# EAGLE design CortexM0DevelopmentBoard (EAGLE 9.6.2)

## Sheet 1 of 2
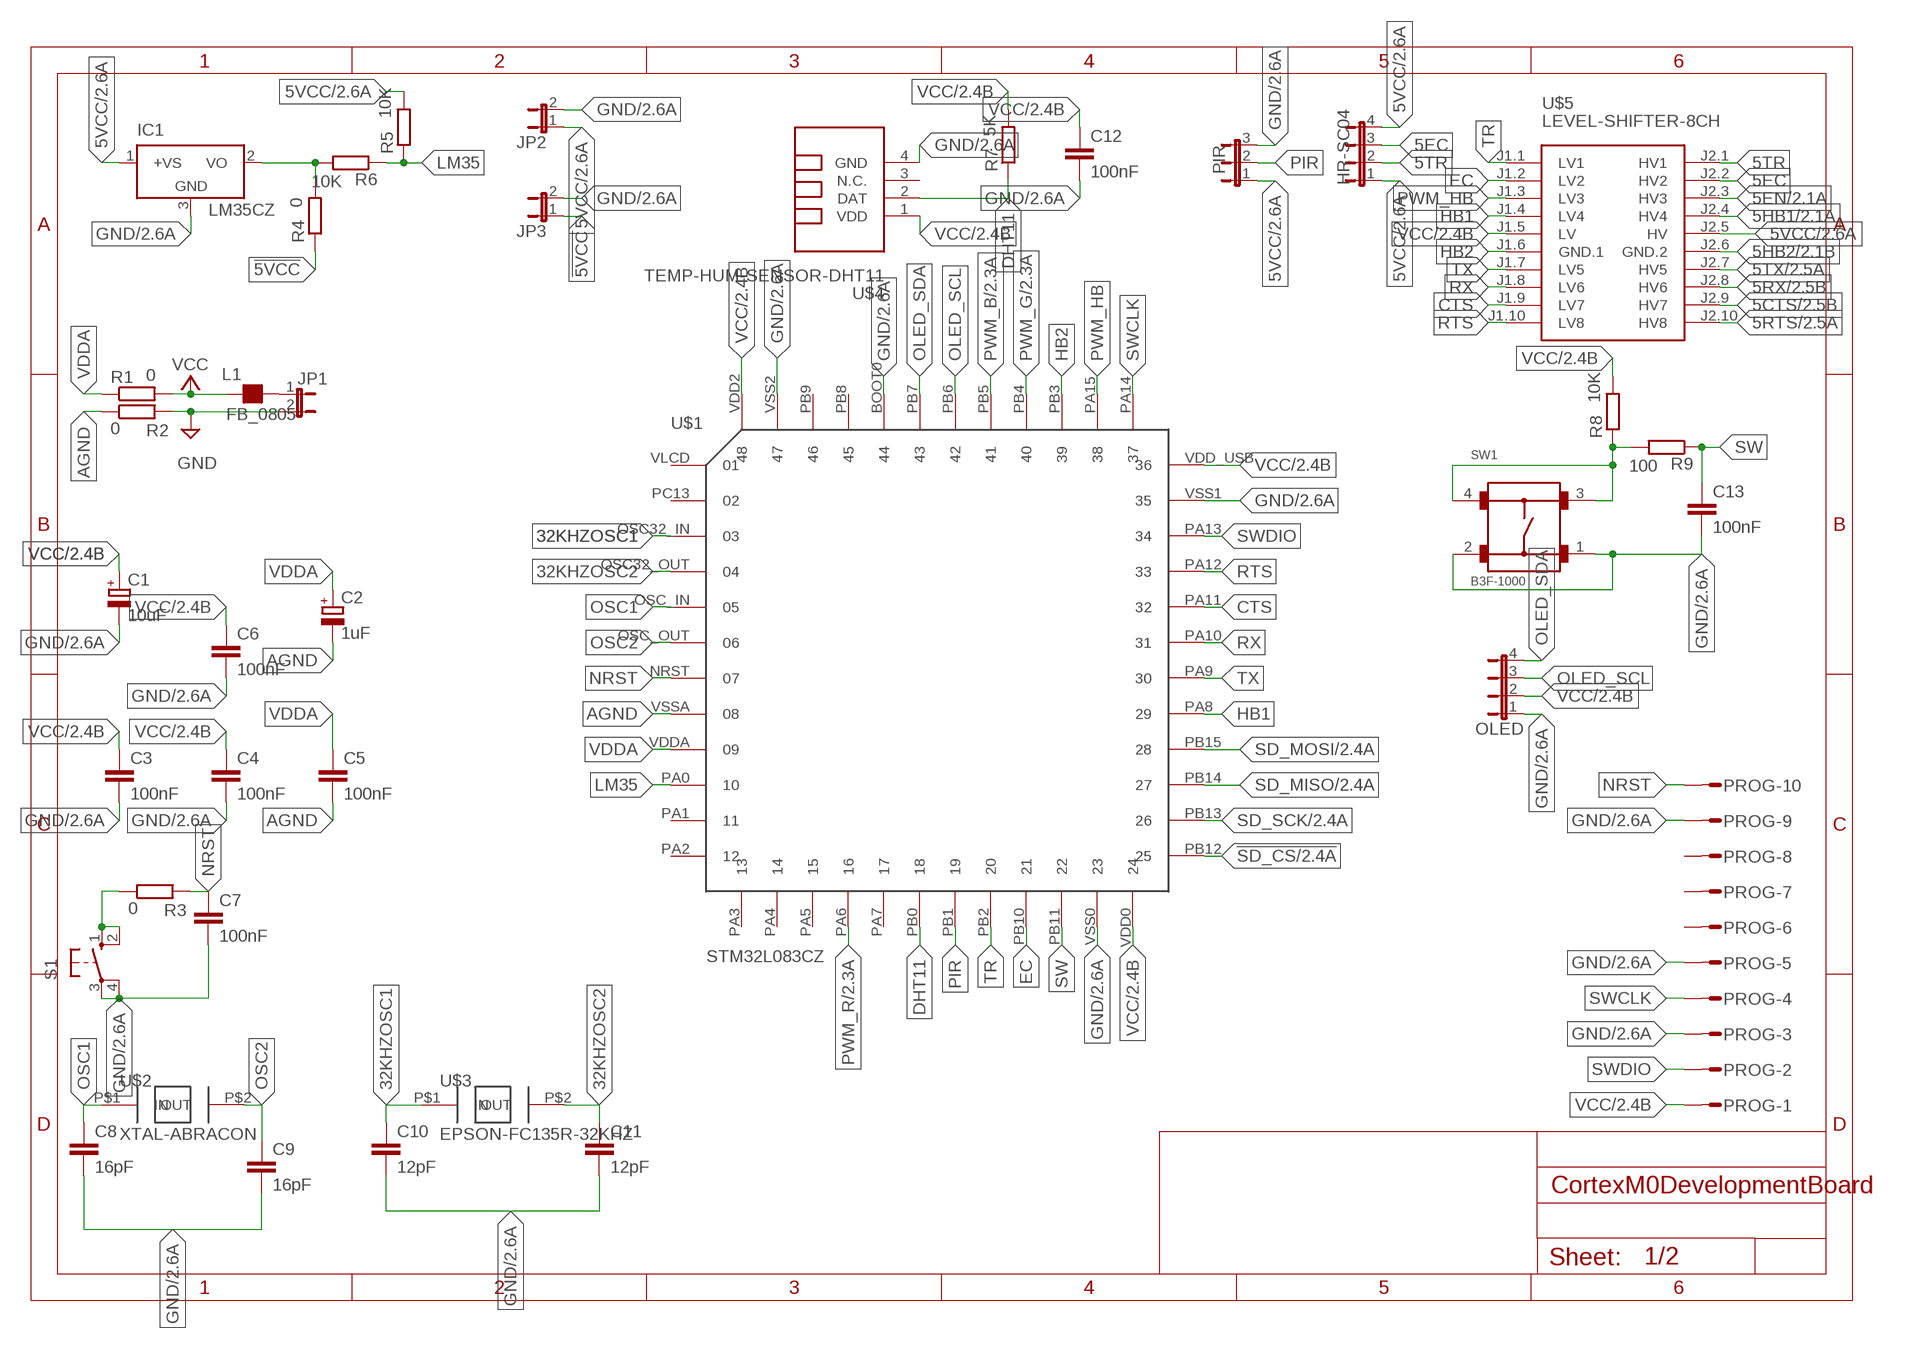
[diagram p0: schematic, sheet 1]

### Parts
C1  10uF  CPOL-EU139CLL-2R  [139CLL-2R]
C2  1uF  CPOL-EU139CLL-2R  [139CLL-2R]
C3  100nF  C-EUC0805  [C0805]
C4  100nF  C-EUC0805  [C0805]
C5  100nF  C-EUC0805  [C0805]
C6  100nF  C-EUC0805  [C0805]
C7  100nF  C-EUC0805  [C0805]
C8  16pF  C-EUC0805  [C0805]
C9  16pF  C-EUC0805  [C0805]
C10  12pF  C-EUC0805  [C0805]
C11  12pF  C-EUC0805  [C0805]
C12  100nF  C-EUC0805  [C0805]
C13  100nF  C-EUC0805  [C0805]
HR-SC04  JP4E  [JP4]
IC1  LM35CZ  [TO92]
JP1  JP1E  [JP1]
JP2  JP1E  [JP1]
JP3  JP1E  [JP1]
L1  FB_0805  [L0805]
OLED  JP4E  [JP4]
PIR  JP2E  [JP2]
PROG  S10P  [S10P]
R1  0  R-EU_R0805  [R0805]
R2  0  R-EU_R0805  [R0805]
R3  0  R-EU_R0805  [R0805]
R4  0  R-EU_R0805  [R0805]
R5  10K  R-EU_R0805  [R0805]
R6  10K  R-EU_R0805  [R0805]
R7  5K  R-EU_R0805  [R0805]
R8  10K  R-EU_R0805  [R0805]
R9  100  R-EU_R0805  [R0805]
S1  10-XX  [B3F-10XX]
SW1  B3F-1000  [B3F-1000]
U$1  STM32L083CZ  [STM32L083CZ-LQFP48]
U$2  XTAL-ABRACON  [XTAL-ABRACON-SMD]
U$3  EPSON-FC135R-32KHZ  [EPSON-32KHZ-FC135R]
U$4  TEMP-HUM-SENSOR-DHT11  [TEMP-HUM-SENSOR-DHT11]
U$5  LEVEL-SHIFTER-8CH  [LEVEL-SHIFTER-8CH]

### Nets
5CTS: U$5.J2.9(HV7) ; also sheet 2
5EC: HR-SC04.3 U$5.J2.2(HV2)
5EN: U$5.J2.3(HV3) ; also sheet 2
5HB1: U$5.J2.4(HV4) ; also sheet 2
5HB2: U$5.J2.6(GND.2) ; also sheet 2
5RTS: U$5.J2.10(HV8) ; also sheet 2
5RX: U$5.J2.8(HV6) ; also sheet 2
5TR: HR-SC04.2 U$5.J2.1(HV1)
5TX: U$5.J2.7(HV5) ; also sheet 2
5VCC: HR-SC04.1 HR-SC04.4 IC1.1(+VS) JP2.1 PIR.1 R5.2 U$5.J2.5(HV) ; also sheet 2
32KHZOSC1: C10.1 U$1.OSC32_IN U$3.P$1(IN)
32KHZOSC2: C11.1 U$1.OSC32_OUT U$3.P$2(OUT)
!5VCC: JP3.1 R4.1
!SD_CS: U$1.PB12 ; also sheet 2
AGND: C2.- C5.2 R2.1 U$1.VSSA
CTS: U$1.PA11 U$5.J1.9(LV7)
DHT11: R7.1 U$1.PB0 U$4.2(DAT)
EC: U$1.PB10 U$5.J1.2(LV2)
GND: C1.- C3.2 C4.2 C6.2 C7.2 C8.2 C9.2 C10.2 C11.2 C12.2 C13.2 IC1.3(GND) JP1.2 JP2.2 JP3.2 OLED.1 PIR.3 PROG.3 PROG.5 PROG.9 R2.2 S1.3(P) S1.4(P1) SW1.1 SW1.2 U$1.BOOT0 U$1.VSS0 U$1.VSS1 U$1.VSS2 U$4.4(GND) ; also sheet 2
HB1: U$1.PA8 U$5.J1.4(LV4)
HB2: U$1.PB3 U$5.J1.6(GND.1)
LM35: R5.1 R6.1 U$1.PA0
N$1: JP1.1 L1.2
N$2: R3.1 S1.1(S) S1.2(S1)
N$3: IC1.2(VO) R4.2 R6.2
N$4: R8.1 R9.2 SW1.3 SW1.4
NRST: C7.1 PROG.10 R3.2 U$1.NRST
OLED_SCL: OLED.3 U$1.PB6
OLED_SDA: OLED.4 U$1.PB7
OSC1: C8.1 U$1.OSC_IN U$2.P$1(IN)
OSC2: C9.1 U$1.OSC_OUT U$2.P$2(OUT)
PIR: PIR.2 U$1.PB1
PWM_B: U$1.PB5 ; also sheet 2
PWM_G: U$1.PB4 ; also sheet 2
PWM_HB: U$1.PA15 U$5.J1.3(LV3)
PWM_R: U$1.PA6 ; also sheet 2
RTS: U$1.PA12 U$5.J1.10(LV8)
RX: U$1.PA10 U$5.J1.8(LV6)
SD_MISO: U$1.PB14 ; also sheet 2
SD_MOSI: U$1.PB15 ; also sheet 2
SD_SCK: U$1.PB13 ; also sheet 2
SW: C13.1 R9.1 U$1.PB11
SWCLK: PROG.4 U$1.PA14
SWDIO: PROG.2 U$1.PA13
TR: U$1.PB2 U$5.J1.1(LV1)
TX: U$1.PA9 U$5.J1.7(LV5)
VCC: C1.+ C3.1 C4.1 C6.1 C12.1 L1.1 OLED.2 PROG.1 R1.2 R7.2 R8.2 U$1.VDD0 U$1.VDD2 U$1.VDD_USB U$4.1(VDD) U$5.J1.5(LV) ; also sheet 2
VDDA: C2.+ C5.1 R1.1 U$1.VDDA
Unconnected: PROG.6 PROG.7 PROG.8 U$1.PA1 U$1.PA2 U$1.PA3 U$1.PA4 U$1.PA5 U$1.PA7 U$1.PB8 U$1.PB9 U$1.PC13 U$1.VLCD U$4.3(N.C.)

## Sheet 2 of 2
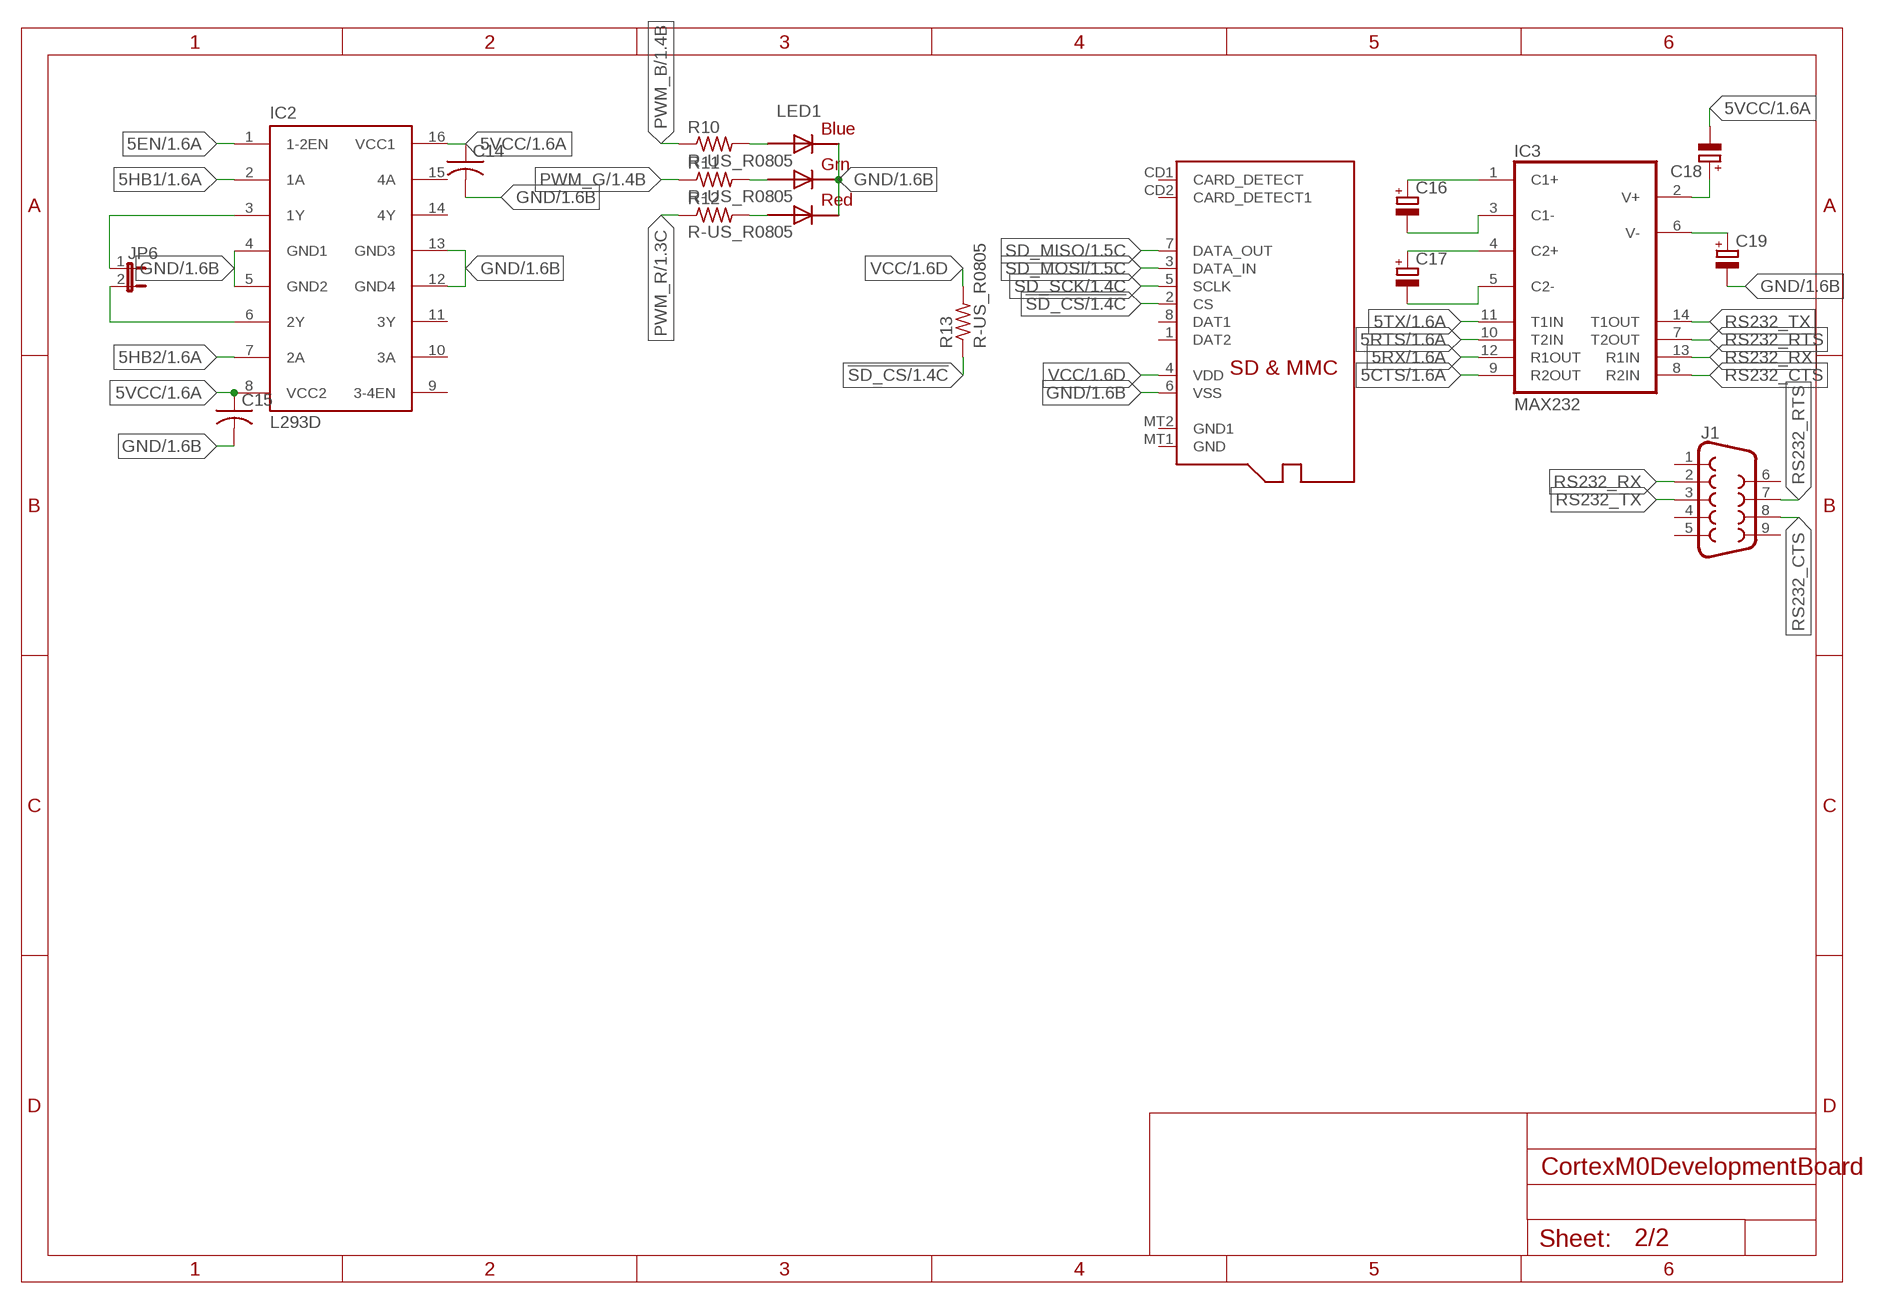
[diagram p1: schematic, sheet 2]

### Parts
C14  C-US_CHIP-0805(2012-METRIC)  [CAPC2012X110]
C15  C-US_CHIP-0805(2012-METRIC)  [CAPC2012X110]
C16  C-POL_TANTALUM-1206(3216-METRIC)  [CAPMP3216X180N]
C17  C-POL_TANTALUM-1206(3216-METRIC)  [CAPMP3216X180N]
C18  C-POL_TANTALUM-1206(3216-METRIC)  [CAPMP3216X180N]
C19  C-POL_TANTALUM-1206(3216-METRIC)  [CAPMP3216X180N]
IC2  L293D  [DIL16]
IC3  MAX232  [DIL16]
J1  DB9FEMALE  [DB9]
JP6  JP1E  [JP1]
LED1  RGBLED5050  [RGBLED5050]
R10  R-US_R0805  [R0805]
R11  R-US_R0805  [R0805]
R12  R-US_R0805  [R0805]
R13  R-US_R0805  [R0805]
U$6  MICROSD  [MICROSD]

### Nets
5CTS: IC3.9(R2OUT) ; also sheet 1
5EN: IC2.1(1-2EN) ; also sheet 1
5HB1: IC2.2(1A) ; also sheet 1
5HB2: IC2.7(2A) ; also sheet 1
5RTS: IC3.10(T2IN) ; also sheet 1
5RX: IC3.12(R1OUT) ; also sheet 1
5TX: IC3.11(T1IN) ; also sheet 1
5VCC: C14.1 C15.1 C18.2(-) IC2.8(VCC2) IC2.16(VCC1) ; also sheet 1
!SD_CS: R13.1 U$6.2(CS) ; also sheet 1
GND: C14.2 C15.2 C19.2(-) IC2.4(GND1) IC2.5(GND2) IC2.12(GND4) IC2.13(GND3) LED1.4(BLUE_C) LED1.5(RED_C) LED1.6(GREEN_C) U$6.6(VSS) ; also sheet 1
N$5: LED1.3(BLUE_A) R10.2
N$6: LED1.1(GREEN_A) R11.2
N$7: LED1.2(RED_A) R12.2
N$8: C16.1(+) IC3.1(C1+)
N$9: C16.2(-) IC3.3(C1-)
N$10: C17.1(+) IC3.4(C2+)
N$11: C17.2(-) IC3.5(C2-)
N$12: IC2.3(1Y) JP6.1
N$13: IC2.6(2Y) JP6.2
N$14: C18.1(+) IC3.2(V+)
N$15: C19.1(+) IC3.6(V-)
PWM_B: R10.1 ; also sheet 1
PWM_G: R11.1 ; also sheet 1
PWM_R: R12.1 ; also sheet 1
RS232_CTS: IC3.8(R2IN) J1.8
RS232_RTS: IC3.7(T2OUT) J1.7
RS232_RX: IC3.13(R1IN) J1.2
RS232_TX: IC3.14(T1OUT) J1.3
SD_MISO: U$6.7(DATA_OUT) ; also sheet 1
SD_MOSI: U$6.3(DATA_IN) ; also sheet 1
SD_SCK: U$6.5(SCLK) ; also sheet 1
VCC: R13.2 U$6.4(VDD) ; also sheet 1
Unconnected: IC2.9(3-4EN) IC2.10(3A) IC2.11(3Y) IC2.14(4Y) IC2.15(4A) J1.1 J1.4 J1.5 J1.6 J1.9 U$6.1(DAT2) U$6.8(DAT1) U$6.CD1(CARD_DETECT) U$6.CD2(CARD_DETECT1) U$6.MT1(GND) U$6.MT2(GND1)

## Power pins joined to a net without a drawn wire
GND: IC3.15(GND)
VCC: IC3.16(VCC)

## Library data of the parts
C1 C2 = rcl:CPOL-EU: POLARIZED CAPACITOR, European symbol; SPICEPREFIX: C
C3-C13 = rcl:C-EU: CAPACITOR, European symbol; SPICEPREFIX: C
C14 C15 = Capacitor:C-US: Capacitor - ANSI; CATEGORY: Capacitor
C16-C19 = Capacitor:C-POL: Capacitor Polarised - Generic; CATEGORY: Capacitor
HR-SC04 OLED = jumper:JP4E: JUMPER
IC1 = lm35:LM35: Single-Supply Centigrade Temperature Sensor Vout = (10mV/°C x Temp °C) +5mmmV Source: http://www.national.com/ds/LM/LM35.pdf
IC2 = st-microelectronics:L293D: PUSH-PULL 4 CHANNEL DRIVER; MPN: L293D; OC_FARNELL: 9589619; OC_NEWARK: 56P8249
IC3 = maxim:MAX232: RS232 TRANSCEIVER; MF: MAXIM; MPN: MAX232ACPE+; OC_FARNELL: 9723773; OC_NEWARK: 68K4544
J1 = SparkFun-Connectors:DB9: DB9 Connector Standard DB9 (D-Sub 9) serial connector. Can be used for CAN bus as well as RS485 and RS232. Footprint production proven. Here is the female version connector we sell at SparkFun: 9 Pin Female Serial Connector - PCB Mount <https://www.sparkfun.com/products/429> (PRT-00429) This connector has been used on the following SparkFun products: SparkFun RS232 Shifter - SMD <https://www.sparkfun.com/products/449> (PRT-00449) SparkFun RS232 Shifter SMD (No DB9) <https://www.sparkfun.com/products/8780> (PRT-08780); PROD_ID: CONN-08194
JP1-JP3 JP6 = jumper:JP1E: JUMPER
L1 = rc-master:FB_: FERRITE BEAD
LED1 = adafruit:RGBLED: For 5050 RGB LEDs, the order of the LEDs may vary from one manufacturer to another!
PIR = jumper:JP2E: JUMPER
PROG = con-amp-mt:S10P: AMP MT CONNECTOR; OC_FARNELL: unknown; OC_NEWARK: unknown
R1-R9 = rcl:R-EU_: RESISTOR, European symbol; SPICEPREFIX: R
R10-R13 = audio amplifier example:R-US_: RESISTOR, American symbol
S1 = switch-omron:10-XX: OMRON SWITCH; MPN: B3F-1000; OC_FARNELL: 176432; OC_NEWARK: 36M3542
SW1 = Switch:B3F-1000: Tactile Switch SPST-NO Top Actuated Through Hole Manufacturer's datasheet <https://omronfs.omron.com/en_US/ecb/products/pdf/en-b3f.pdf>; CREATED_BY: PCBLayout.com; DIGI_KEY_PART_NUMBER: SW400-ND; MANUFACTURER: Omron Electronics Inc-EMC Div; MPN: B3F-1000; PACKAGE: SPST-NO
U$1 = STM32L083:STM32L083CZ
U$2 = XTAL-SAM:XTAL-ABRACON
U$3 = XTAL-SAM:EPSON-FC135R-32KHZ
U$4 = DHT11:TEMP-HUM-SENSOR-DHT11: DHT11 - digital humidity & temperature sensor DHT11 datasheet available here: https://akizukidenshi.com/download/ds/aosong/DHT11.pdf Click here to find device on ebay.com <http://www.ebay.com/sch/dht11+digital+sensor>
U$5 = BiDirectionalLevelShifter:LEVEL-SHIFTER-8CH: 8-Channel Bi-Directional Logic Level Converter based on BSS128 transistors Click here to find device on ebay.com <http://www.ebay.com/sch/8+channel+level+converter> Note: There are many variants. Search for the proper version.
U$6 = adafruit:MICROSD: Micro-SD / Transflash card holder with SPI pinout For the 3M # 2908-05WB-MG and/or 4UCON #19656 push-push type

## Board
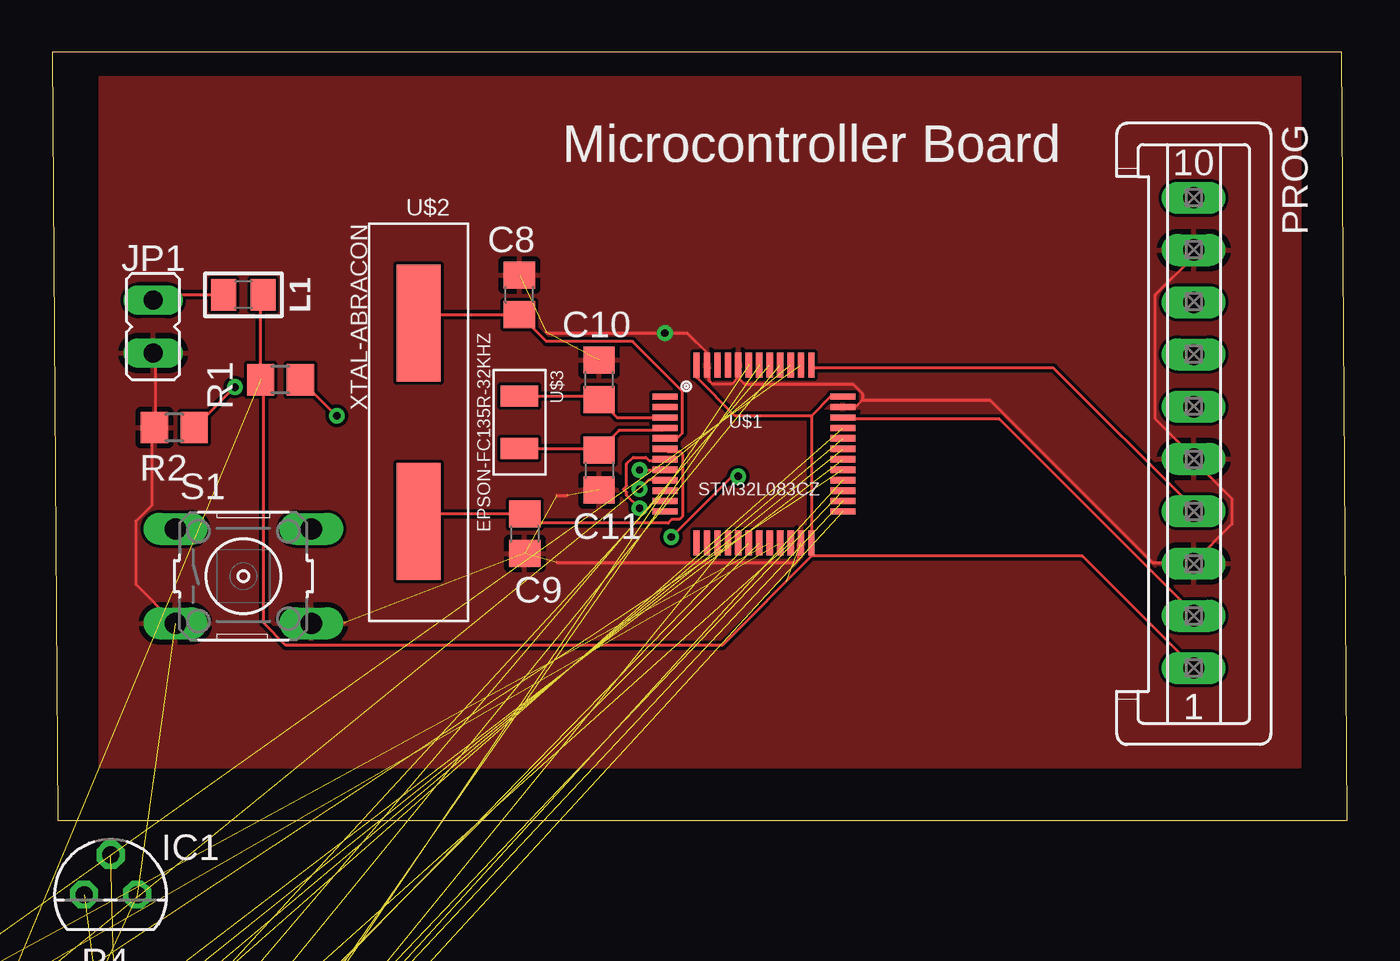
[diagram p2: board, top side]
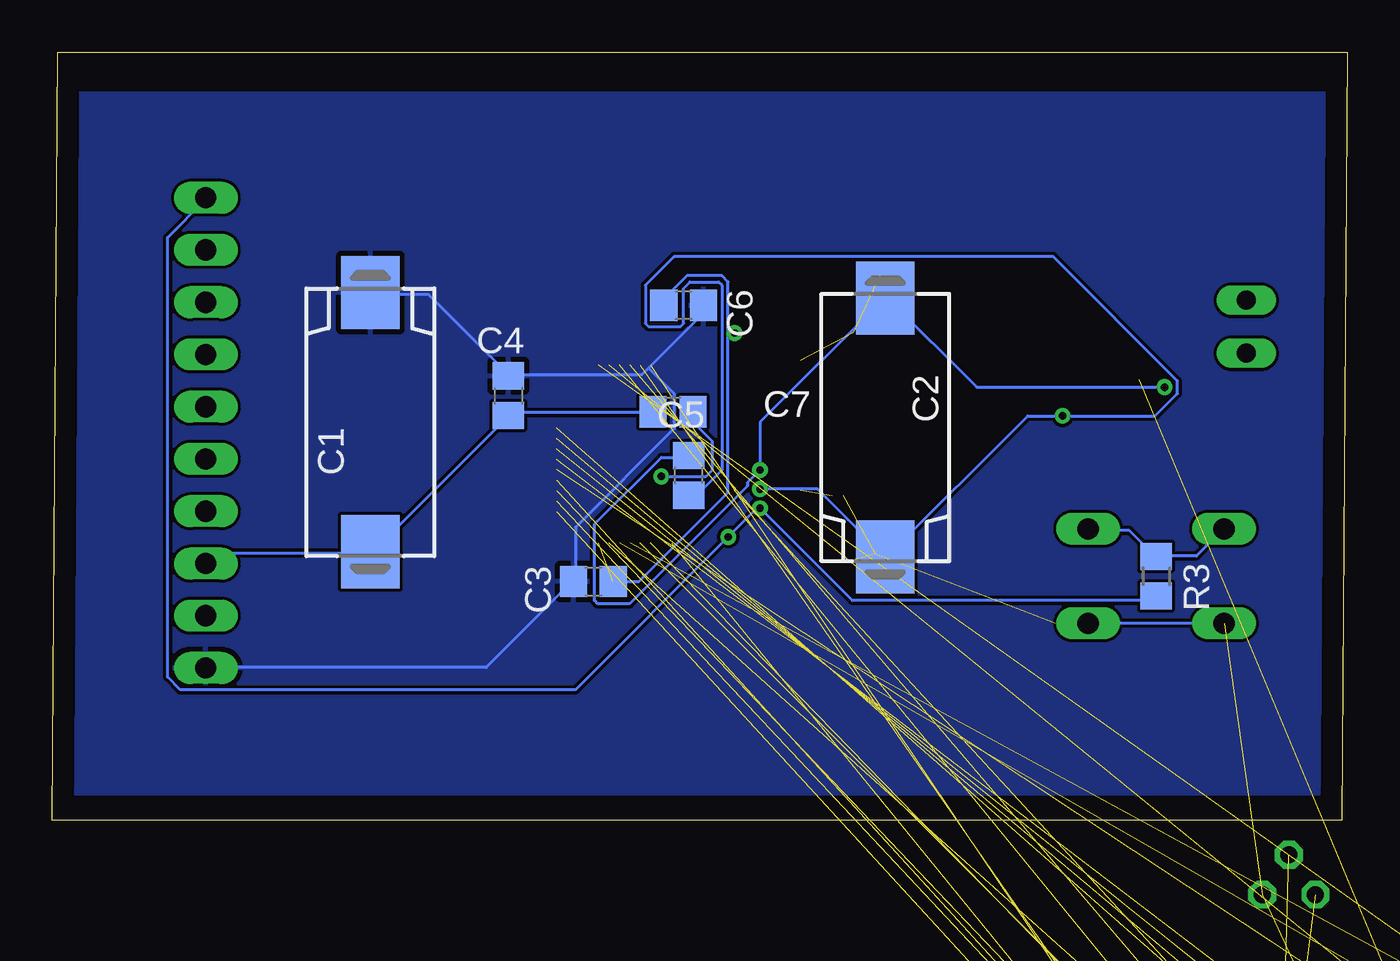
[diagram p3: board, bottom side, seen from below]

Size 61.96 x 36.75 mm. Coordinates in mm from the lower left corner, seen from the top.
Outline: 0.25,0 61.96,0 61.7,36.75 0,36.75 0.25,0
Copper layers (1*16): Top 0.035mm / dielectric 1.5mm / Bottom 0.035mm
Design rules "default": minimum track width 6mil, minimum drill 0.35mm, track to track 6mil, track to pad 6mil, pad to pad 6mil, via to via 6mil, smd to smd 6mil, copper to edge 40mil, drill to drill 6mil, minimum pad ring 10mil, minimum via ring 8mil, stop-mask expansion 4mil, vias tented up to drill 0mil, thermal gap 10mil

### Footprints (pad centres in the part's own frame; a part is rotated, then mirrored left to right if it is on the bottom)
139CLL-2R = smd 3.5 x 2.8: + 6.2,0; - -6.2,0
C0805 = smd 1.3 x 1.5: 1 -0.95,0; 2 0.95,0
CAPC2012X110 = smd 1.165 x 1.465: 1 -0.875,0; 2 0.875,0
CAPMP3216X180N = smd 1.796 x 1.189: 1 -1.31,0; 2 1.31,0
JP4 = drill 0.914 long: 1 -3.81,0; 2 -1.27,0; 3 1.27,0; 4 3.81,0
TO92 = drill 0.813 octagon: 1 -1.27,0; 2 0,1.905; 3 1.27,0
DIL16 = drill 0.813 long: 1 -8.89,-3.81; 2 -6.35,-3.81; 3 -3.81,-3.81; 4 -1.27,-3.81; 5 1.27,-3.81; 6 3.81,-3.81; 7 6.35,-3.81; 8 8.89,-3.81; 9 8.89,3.81; 10 6.35,3.81; 11 3.81,3.81; 12 1.27,3.81; 13 -1.27,3.81; 14 -3.81,3.81; 15 -6.35,3.81; 16 -8.89,3.81
DB9 = drill 1.016 pad 1.88 square: 1 -5.54,-1.42 | drill 1.016 pad 1.88: 2 -2.77,-1.42; 3 0,-1.42; 4 2.77,-1.42; 5 5.54,-1.42; 6 -4.15,1.42; 7 -1.38,1.42; 8 1.38,1.42; 9 4.15,1.42 | drill 3.302 pad 5.08: G1 -12.5,0; G2 12.5,0
JP1 = drill 0.914 long: 1 0,-1.27; 2 0,1.27
L0805 = smd 1.2 x 1.5: 1 -0.953,0; 2 0.953,0
RGBLED5050 = smd 2 x 1.1: 1 -2,1.7; 2 -2,0; 3 -2,-1.7; 4 2,-1.7; 5 2,0; 6 2,1.7
JP2 = drill 0.914 long: 1 -2.54,0; 2 0,0; 3 2.54,0
S10P = drill 1.016 long: 1 11.25,0; 2 8.75,0; 3 6.25,0; 4 3.75,0; 5 1.25,0; 6 -1.25,0; 7 -3.75,0; 8 -6.25,0; 9 -8.75,0; 10 -11.25,0
R0805 = smd 1.3 x 1.5: 1 -0.95,0; 2 0.95,0
R0805' = smd 1.1 x 1.4: 1 -1,0; 2 1,0
B3F-10XX = drill 1.016 long: 1 -3.251,2.261; 2 3.251,2.261; 3 -3.251,-2.261; 4 3.251,-2.261
B3F-1000 = drill 1 pad 1.6: 1 -3.25,2.25; 2 3.25,2.25; 3 -3.25,-2.25; 4 3.25,-2.25
STM32L083CZ-LQFP48 = smd 0.3 x 1.2: BOOT0 -0.45,4.25; PA3 -2.45,-4.25; PA4 -1.95,-4.25; PA5 -1.45,-4.25; PA6 -0.95,-4.25; PA7 -0.45,-4.25; PA14 3.05,4.25; PA15 2.55,4.25; PB0 0.05,-4.25; PB1 0.55,-4.25; PB2 1.05,-4.25; PB3 2.05,4.25; PB4 1.55,4.25; PB5 1.05,4.25; PB6 0.55,4.25; PB7 0.05,4.25; PB8 -0.95,4.25; PB9 -1.45,4.25; PB10 1.55,-4.25; PB11 2.05,-4.25; VDD0 3.05,-4.25; VDD2 -2.45,4.25; VSS0 2.55,-4.25; VSS2 -1.95,4.25 | smd 1.2 x 0.3: NRST -3.95,-0.25; OSC32_IN -3.95,1.75; OSC32_OUT -3.95,1.25; OSC_IN -3.95,0.75; OSC_OUT -3.95,0.25; PA0 -3.95,-1.75; PA1 -3.95,-2.25; PA2 -3.95,-2.75; PA8 4.55,-0.75; PA9 4.55,-0.25; PA10 4.55,0.25; PA11 4.55,0.75; PA12 4.55,1.25; PA13 4.55,1.75; PB12 4.55,-2.75; PB13 4.55,-2.25; PB14 4.55,-1.75; PB15 4.55,-1.25; PC13 -3.95,2.25; VDD_USB 4.55,2.75; VDDA -3.95,-1.25; VLCD -3.95,2.75; VSS1 4.55,2.25; VSSA -3.95,-0.75
XTAL-ABRACON-SMD = smd 5.6 x 2.1: P$1 -4.75,0; P$2 4.75,0
EPSON-32KHZ-FC135R = smd 1 x 1.8: P$1 -1.25,0; P$2 1.25,0
TEMP-HUM-SENSOR-DHT11 = drill 0.8 square: 1 -3.81,0 | drill 0.8: 2 -1.27,0; 3 1.27,0; 4 3.81,0
LEVEL-SHIFTER-8CH = drill 1 square: J1.1 -5.715,11.43; J2.1 5.715,11.43 | drill 1: J1.2 -5.715,8.89; J1.3 -5.715,6.35; J1.4 -5.715,3.81; J1.5 -5.715,1.27; J1.6 -5.715,-1.27; J1.7 -5.715,-3.81; J1.8 -5.715,-6.35; J1.9 -5.715,-8.89; J1.10 -5.715,-11.43; J2.2 5.715,8.89; J2.3 5.715,6.35; J2.4 5.715,3.81; J2.5 5.715,1.27; J2.6 5.715,-1.27; J2.7 5.715,-3.81; J2.8 5.715,-6.35; J2.9 5.715,-8.89; J2.10 5.715,-11.43
MICROSD = smd 0.7 x 1.5: 1 9,-10.64; 2 7.9,-10.24; 3 6.8,-10.64; 4 5.7,-11.04; 5 4.6,-10.64; 6 3.5,-11.04; 7 2.4,-10.64; 8 1.3,-10.64 | smd 1.8 x 1.4: CD1 2,-0.44; CD2 8,-0.44 | smd 1.4 x 1.9: MT1 0.4,-13.54; MT2 13.6,-14.44

### Placement (x,y rotation side)
C1  46.74,19.05 90 bottom
C2  22.1,18.8 270 bottom
C3  36.07,11.43 0 bottom
C4  40.13,20.32 270 bottom
C5  31.5,16.51 90 bottom
C6  31.75,24.64 180 bottom
C7  32.26,19.56 180 bottom
C8  22.35,25.15 90 top
C9  22.61,13.72 270 top
C10  26.16,21.08 90 top
C11  26.16,16.76 270 top
C12  -18.03,-46.48 0 top  (outside the outline)
C13  -52.07,-72.14 0 top  (outside the outline)
C14  -57.4,-89.41 0 top  (outside the outline)
C15  -57.4,-94.23 0 top  (outside the outline)
C16  -80.77,-139.45 0 top  (outside the outline)
C17  -80.77,-144.02 0 top  (outside the outline)
C18  -80.77,-148.59 0 top  (outside the outline)
C19  -80.77,-153.16 0 top  (outside the outline)
HR-SC04  -22.61,-53.09 0 top  (outside the outline)
IC1  2.79,-3.56 0 top
IC2  -41.66,-80.52 0 top  (outside the outline)
IC3  -72.14,-130.56 0 top  (outside the outline)
J1  -68.83,-170.18 0 top  (outside the outline)
JP1  4.83,23.62 180 top
JP2  -3.56,-21.34 0 top  (outside the outline)
JP3  -10.67,-21.34 0 top  (outside the outline)
JP6  -57.66,-82.8 0 top  (outside the outline)
L1  9.14,25.15 180 top
LED1  -66.04,-90.68 0 top  (outside the outline)
OLED  -63.5,-116.33 0 top  (outside the outline)
PIR  -24.13,-44.7 0 top  (outside the outline)
PROG  54.61,18.54 270 top
R1  10.92,21.08 180 top
R2  5.84,18.8 180 top
R3  9.14,11.68 270 bottom
R4  2.03,-8.64 0 top  (outside the outline)
R5  2.03,-14.99 0 top  (outside the outline)
R6  2.03,-21.34 0 top  (outside the outline)
R7  -18.03,-40.13 0 top  (outside the outline)
R8  -52.07,-59.44 0 top  (outside the outline)
R9  -52.07,-65.79 0 top  (outside the outline)
R10  R-US_R0805  [R0805']  -67.06,-98.3 0 top  (outside the outline)
R11  R-US_R0805  [R0805']  -67.06,-104.14 0 top  (outside the outline)
R12  R-US_R0805  [R0805']  -67.06,-109.98 0 top  (outside the outline)
R13  R-US_R0805  [R0805']  -82.55,-122.43 0 top  (outside the outline)
S1  9.14,11.68 0 top
SW1  -49.28,-50.55 0 top  (outside the outline)
U$1  33.27,17.53 0 top
U$2  17.53,19.05 270 top
U$3  22.35,19.05 270 top
U$4  -7.62,-30.23 0 top  (outside the outline)
U$5  -35.31,-39.12 0 top  (outside the outline)
U$6  -83.57,-98.81 0 top  (outside the outline)

### Tracks (layer width: path | path; a pad name or v marks a point on that pad's centre or on a via)
5CTS  (1 unrouted)
5EC  (1 unrouted)
5EN  (1 unrouted)
5HB1  (1 unrouted)
5HB2  (1 unrouted)
5RTS  (1 unrouted)
5RX  (1 unrouted)
5TR  (1 unrouted)
5TX  (1 unrouted)
5VCC  (11 unrouted)
32KHZOSC1
  Top 0.152: U$3.P$1 26.16,20.3 C10.1 27.02,19.28 U$1.OSC32_IN
32KHZOSC2
  Top 0.152: U$3.P$2 26.08,17.8 C11.1 27.11,18.65 29.2,18.65 U$1.OSC32_OUT
!5VCC  (1 unrouted)
!SD_CS  (2 unrouted)
AGND  (via drill 0.35)
  Top 0.152: v28.09,16.76 29.31,16.76 U$1.VSSA | v8.74,20.73 6.91,18.9 R2.1
  Bottom 0.152: v8.74,20.73 17.73,20.73 22,24.99 C2.- 22.15,24.99 28.09,19.05 v28.09,16.76 28.7,16.15 28.7,16 34.34,10.36 35.87,10.36 36.02,10.52 36.02,14.17 32.82,17.37 31.6,17.37 C5.2
CTS  (1 unrouted)
DHT11  (2 unrouted)
EC  (1 unrouted)
GND  (via drill 0.35)  (29 unrouted)
  Top 0.152: 54.61,12.34 56.44,14.17 56.44,15.39 54.61,17.22 PROG.5 54.61,17.37 52.78,19.2 52.78,25.15 54.61,26.97 PROG.9 | JP1.2 4.93,22.25 4.93,18.9 R2.2 4.78,18.75 4.78,15.09 4.01,14.33 4.01,11.28 5.84,9.45 S1.3 | 32.82,21.18 32.51,20.88 31.6,20.88 31.45,21.03 31.45,21.64 U$1.VSS2 31.29,21.79 31.29,22.4 30.38,23.32 v29.31,23.32 23.67,23.32 23.62,23.36 | 32.82,21.18 32.82,21.64 U$1.BOOT0 32.82,21.18 | 38.76,20.12 38.46,19.81 37.85,19.81 U$1.VSS1 | 38.76,20.12 38.76,20.42 38.3,20.88 33.12,20.88 32.82,21.18 | 24.13,12.34 35.56,12.34 35.71,12.5 35.71,13.26 U$1.VSS0 | 24.13,15.54 24.64,15.54 | 13.97,9.45 12.39,9.45 S1.4 | 54.61,12.34 52.63,12.34 44.86,20.12 38.76,20.12 | 54.61,12.34 PROG.3
  Bottom 0.152: C7.2 33.27,19.51 40.13,19.51 C4.2 40.13,19.36 46.69,12.8 C1.- 46.84,12.8 54.15,12.8 54.61,12.34 PROG.3 | S1.3 5.99,9.45 12.39,9.45 S1.4 | 29.62,23.32 29.62,15.7 33.88,11.43 C3.2 | 29.62,23.32 29.62,25.76 29.92,26.06 31.6,26.06 32.66,24.99 32.66,24.69 C6.2 | v29.31,23.32 29.62,23.32
  pour Top: 13.97,20.07 13.97,28.96 23.62,28.96 23.62,22.61 23.37,22.61 19.56,22.61 19.56,16.26 19.56,16 24.13,16 24.13,8.89 23.88,8.89 13.97,8.89
  pour Top: 20.57,21.84 24.64,21.84 24.64,23.62 27.69,23.62 27.69,13.72 24.64,13.72 24.64,16.51 20.57,16.51
  pour Top: 2.29,35.56 59.69,35.56 59.69,2.54 2.29,2.54
HB1  (1 unrouted)
HB2  (1 unrouted)
LM35  (2 unrouted)
N$1
  Top 0.152: L1.2 5.08,25.15 JP1.1
N$2
  Bottom 0.152: S1.1 5.99,13.87 7.21,12.65 9.04,12.65 R3.1 9.2,12.65 10.41,13.87 12.39,13.87 S1.2
N$3  (2 unrouted)
N$4  (3 unrouted)
N$5  (1 unrouted)
N$6  (1 unrouted)
N$7  (1 unrouted)
N$8  (1 unrouted)
N$9  (1 unrouted)
N$10  (1 unrouted)
N$11  (1 unrouted)
N$12  (1 unrouted)
N$13  (1 unrouted)
N$14  (1 unrouted)
N$15  (1 unrouted)
NRST  (via drill 0.35)
  Top 0.152: v28.09,14.93 27.48,15.54 27.48,15.7 27.33,15.85 27.48,16 27.48,17.07 27.79,17.37 28.4,17.37 28.55,17.22 29.31,17.22 U$1.NRST | v32.82,16.46 32.51,16.46 v29.62,13.56
  Bottom 0.152: R3.2 9.2,10.67 9.35,10.52 23.67,10.52 v28.09,14.93 28.25,14.93 v29.62,13.56 36.93,6.25 55.83,6.25 56.44,6.86 56.44,27.89 54.61,29.72 PROG.10 | v32.82,16.46 30.68,16.46 30.38,16.76 30.38,18.14 31.29,19.05 31.29,19.51 C7.1
OLED_SCL  (1 unrouted)
OLED_SDA  (1 unrouted)
OSC1
  Top 0.152: U$1.OSC_IN 29.4,18.35 29.97,18.35 30.15,18.53 30.15,20.52 27.76,22.91 23.64,22.91 C8.1 17.92,24.2 U$2.P$1
OSC2
  Top 0.152: U$1.OSC_OUT 29.45,17.65 30.02,17.65 30.15,17.52 30.15,14.53 30.02,14.4 29.64,14.4 29.46,14.22 23.05,14.22 C9.1 17.85,14.67 17.53,14.99 U$2.P$2
PIR  (1 unrouted)
PWM_B  (1 unrouted)
PWM_G  (1 unrouted)
PWM_HB  (1 unrouted)
PWM_R  (1 unrouted)
RS232_CTS  (1 unrouted)
RS232_RTS  (1 unrouted)
RS232_RX  (1 unrouted)
RS232_TX  (1 unrouted)
RTS  (1 unrouted)
RX  (1 unrouted)
SD_MISO  (1 unrouted)
SD_MOSI  (1 unrouted)
SD_SCK  (1 unrouted)
SW  (2 unrouted)
SWCLK
  Top 0.152: U$1.PA14 36.32,21.64 47.9,21.64 54.61,14.93 PROG.4
SWDIO
  Top 0.152: U$1.PA13 37.85,19.2 45.31,19.2 54.61,9.91 PROG.2
TR  (1 unrouted)
TX  (1 unrouted)
VCC  (9 unrouted)
  Top 0.152: L1.1 9.96,25.15 9.96,21.18 R1.2 10.11,21.03 10.11,9.45 11.18,8.38 32.06,8.38 36.32,12.65 | 36.32,19.36 36.32,13.41 U$1.VDD0 36.32,13.26 36.32,12.65 | 36.32,19.36 37.24,20.27 37.69,20.27 U$1.VDD_USB | 36.32,19.36 32.66,19.36 30.84,21.18 30.84,21.64 U$1.VDD2 | 36.32,12.65 49.28,12.65 54.61,7.32 PROG.1
  Bottom 0.152: 33.43,21.64 33.73,21.34 40.13,21.34 | 33.43,21.64 30.84,24.23 30.84,24.54 C6.1 | 33.43,21.64 32.21,20.42 32.21,18.75 36.93,14.02 36.93,11.43 C3.1 37.08,11.43 41.2,7.32 54.61,7.32 PROG.1 | 40.13,21.34 43.94,25.15 46.69,25.15 C1.+ | 40.13,21.34 C4.1
  pour Bottom: 1.02,34.8 60.96,34.8 60.96,1.27 1.02,1.27
VDDA  (via drill 0.35)
  Top 0.152: v28.09,15.85 28.55,16.31 29.31,16.31 U$1.VDDA | v13.61,19.36 11.94,21.03 R1.1
  Bottom 0.152: v28.09,15.85 25.35,15.85 22.15,12.65 C2.+ 22,12.65 15.29,19.36 v13.61,19.36 9.2,19.36 8.13,20.42 8.13,21.03 14.07,26.97 32.21,26.97 33.58,25.6 33.58,23.77 33.43,23.62 31.9,23.62 31.75,23.77 31.75,25.45 31.45,25.76 30.07,25.76 29.92,25.6 29.92,16.76 30.99,15.7 31.45,15.7 C5.1

### Text on the board
tPlace: Microcontroller Board